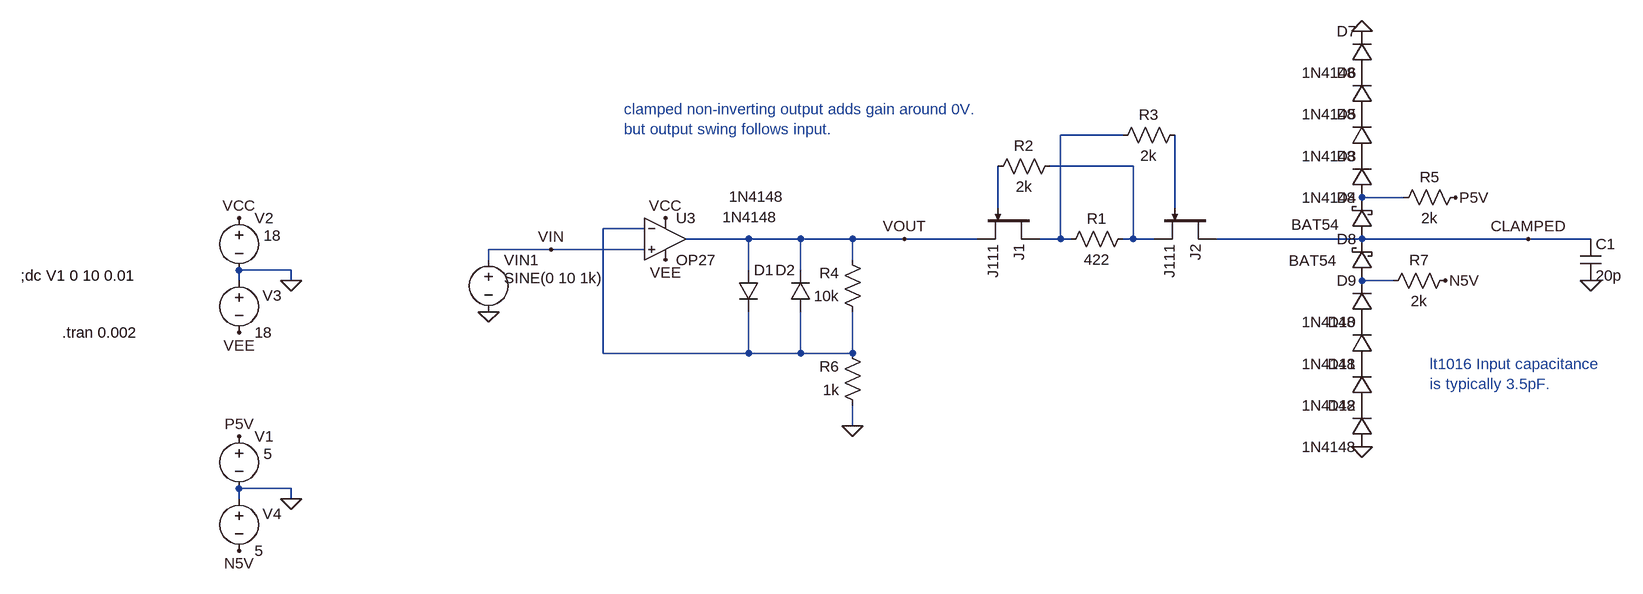
[diagram p0: schematic Draft24.asc]
Draft24.asc, the LTspice schematic file:
Version 4
SHEET 1 3336 1280
WIRE 1216 -176 1120 -176
WIRE 1232 -128 1104 -128
WIRE 1648 -80 1584 -80
WIRE 1024 -64 1024 -128
WIRE 1296 -64 1296 -176
WIRE 480 -32 416 -32
WIRE 640 -16 544 -16
WIRE 720 -16 640 -16
WIRE 800 -16 720 -16
WIRE 880 -16 800 -16
WIRE 992 -16 880 -16
WIRE 1120 -16 1120 -176
WIRE 1120 -16 1088 -16
WIRE 1136 -16 1120 -16
WIRE 1232 -16 1232 -128
WIRE 1232 -16 1216 -16
WIRE 1264 -16 1232 -16
WIRE 1584 -16 1360 -16
WIRE 1840 -16 1584 -16
WIRE 1936 -16 1840 -16
WIRE 336 0 240 0
WIRE 480 0 336 0
WIRE 240 16 240 0
WIRE 800 16 800 -16
WIRE -64 32 -144 32
WIRE 640 32 640 -16
WIRE 720 32 720 -16
WIRE -144 48 -144 32
WIRE -64 48 -64 32
WIRE 1632 48 1584 48
WIRE 416 160 416 -32
WIRE 640 160 640 96
WIRE 640 160 416 160
WIRE 720 160 720 96
WIRE 720 160 640 160
WIRE 800 160 800 96
WIRE 800 160 720 160
WIRE 800 272 800 240
WIRE -64 368 -144 368
WIRE -144 384 -144 368
WIRE -64 384 -64 368
FLAG -64 48 0
FLAG -144 -48 VCC
FLAG -144 128 VEE
FLAG 240 96 0
FLAG 880 -16 VOUT
FLAG 512 -48 VCC
FLAG 512 16 VEE
FLAG 800 272 0
FLAG 336 0 VIN
FLAG 1584 -336 0
FLAG 1584 304 0
FLAG -64 384 0
FLAG -144 288 P5V
FLAG -144 464 N5V
FLAG 1728 -80 P5V
FLAG 1712 48 N5V
FLAG 1936 48 0
FLAG 1840 -16 CLAMPED
SYMBOL voltage -144 -64 R0
WINDOW 123 0 0 Left 0
WINDOW 39 0 0 Left 0
WINDOW 3 38 43 Left 2
SYMATTR Value 18
SYMATTR InstName V2
SYMBOL voltage -144 32 R0
WINDOW 123 0 0 Left 0
WINDOW 39 0 0 Left 0
WINDOW 0 36 39 Left 2
SYMATTR InstName V3
SYMATTR Value 18
SYMBOL voltage 240 0 R0
WINDOW 123 0 0 Left 0
WINDOW 39 0 0 Left 0
WINDOW 3 24 44 Left 2
SYMATTR Value SINE(0 10 1k)
SYMATTR InstName VIN1
SYMBOL res 816 112 R180
WINDOW 0 36 76 Left 2
WINDOW 3 36 40 Left 2
SYMATTR InstName R4
SYMATTR Value 10k
SYMBOL OpAmps\\OP27 512 -80 R0
SYMATTR InstName U3
SYMBOL res 816 256 R180
WINDOW 0 36 76 Left 2
WINDOW 3 36 40 Left 2
SYMATTR InstName R6
SYMATTR Value 1k
SYMBOL diode 624 32 R0
WINDOW 3 -14 -113 Left 2
SYMATTR Value 1N4148
SYMATTR InstName D1
SYMBOL diode 736 96 R180
WINDOW 0 24 64 Left 2
WINDOW 3 51 146 Left 2
SYMATTR InstName D2
SYMATTR Value 1N4148
SYMBOL njf 1088 -64 R90
SYMATTR InstName J1
SYMATTR Value J111
SYMBOL njf 1360 -64 R90
SYMATTR InstName J2
SYMATTR Value J111
SYMBOL res 1232 -32 R90
WINDOW 0 0 56 VBottom 2
WINDOW 3 32 56 VTop 2
SYMATTR InstName R1
SYMATTR Value 422
SYMBOL res 1120 -144 R90
WINDOW 0 0 56 VBottom 2
WINDOW 3 32 56 VTop 2
SYMATTR InstName R2
SYMATTR Value 2k
SYMBOL res 1312 -192 R90
WINDOW 0 0 56 VBottom 2
WINDOW 3 32 56 VTop 2
SYMATTR InstName R3
SYMATTR Value 2k
SYMBOL diode 1600 -80 R180
WINDOW 0 24 64 Left 2
WINDOW 3 24 0 Left 2
SYMATTR InstName D3
SYMATTR Value 1N4148
SYMBOL schottky 1600 -16 R180
WINDOW 0 24 64 Left 2
WINDOW 3 51 22 Left 2
SYMATTR InstName D4
SYMATTR Value BAT54
SYMATTR Description Diode
SYMATTR Type diode
SYMBOL diode 1600 -144 R180
WINDOW 0 24 64 Left 2
WINDOW 3 24 0 Left 2
SYMATTR InstName D5
SYMATTR Value 1N4148
SYMBOL diode 1600 -208 R180
WINDOW 0 24 64 Left 2
WINDOW 3 24 0 Left 2
SYMATTR InstName D6
SYMATTR Value 1N4148
SYMBOL diode 1600 -272 R180
WINDOW 0 24 64 Left 2
WINDOW 3 24 0 Left 2
SYMATTR InstName D7
SYMATTR Value 1N4148
SYMBOL schottky 1600 48 R180
WINDOW 0 24 64 Left 2
WINDOW 3 55 31 Left 2
SYMATTR InstName D8
SYMATTR Value BAT54
SYMATTR Description Diode
SYMATTR Type diode
SYMBOL diode 1600 112 R180
WINDOW 0 24 64 Left 2
WINDOW 3 24 0 Left 2
SYMATTR InstName D9
SYMATTR Value 1N4148
SYMBOL diode 1600 176 R180
WINDOW 0 24 64 Left 2
WINDOW 3 24 0 Left 2
SYMATTR InstName D10
SYMATTR Value 1N4148
SYMBOL diode 1600 240 R180
WINDOW 0 24 64 Left 2
WINDOW 3 24 0 Left 2
SYMATTR InstName D11
SYMATTR Value 1N4148
SYMBOL diode 1600 304 R180
WINDOW 0 24 64 Left 2
WINDOW 3 24 0 Left 2
SYMATTR InstName D12
SYMATTR Value 1N4148
SYMBOL voltage -144 272 R0
WINDOW 123 0 0 Left 0
WINDOW 39 0 0 Left 0
WINDOW 3 38 43 Left 2
SYMATTR Value 5
SYMATTR InstName V1
SYMBOL voltage -144 368 R0
WINDOW 123 0 0 Left 0
WINDOW 39 0 0 Left 0
WINDOW 0 36 39 Left 2
SYMATTR InstName V4
SYMATTR Value 5
SYMBOL res 1744 -96 R90
WINDOW 0 0 56 VBottom 2
WINDOW 3 32 56 VTop 2
SYMATTR InstName R5
SYMATTR Value 2k
SYMBOL res 1728 32 R90
WINDOW 0 0 56 VBottom 2
WINDOW 3 32 56 VTop 2
SYMATTR InstName R7
SYMATTR Value 2k
SYMBOL cap 1920 -16 R0
SYMATTR InstName C1
SYMATTR Value 20p
TEXT -480 40 Left 2 !;dc V1 0 10 0.01
TEXT -416 128 Left 2 !.tran 0.002
TEXT 448 -216 Left 2 ;clamped non-inverting output adds gain around 0V. \nbut output swing follows input.
TEXT 1688 176 Left 2 ;lt1016 Input capacitance\nis typically 3.5pF.

The netlist it stands for:
* Draft24.asc
V2 VCC 0 18
V3 0 VEE 18
VIN1 VIN 0 SINE(0 10 1k)
R4 N006 VOUT 10k
XU3 VIN N006 VCC VEE VOUT OP27  ; pins In+ In- V+ V- OUT
R6 0 N006 1k
D1 VOUT N006 1N4148
D2 N006 VOUT 1N4148
J1 N001 N004 VOUT J111
J2 CLAMPED N005 N002 J111
R1 N002 N001 422
R2 N002 N004 2k
R3 N005 N001 2k
D3 N003 P001 1N4148
D4 CLAMPED N003 BAT54
D5 P001 P002 1N4148
D6 P002 P003 1N4148
D7 P003 0 1N4148
D8 N007 CLAMPED BAT54
D9 P004 N007 1N4148
D10 P005 P004 1N4148
D11 P006 P005 1N4148
D12 0 P006 1N4148
V1 P5V 0 5
V4 0 N5V 5
R5 P5V N003 2k
R7 N5V N007 2k
C1 CLAMPED 0 20p
.model D D
.lib standard.dio
.model NJF NJF
.model PJF PJF
.lib standard.jft
;dc V1 0 10 0.01
.tran 0.002
* clamped non-inverting output adds gain around 0V.
* but output swing follows input.
* lt1016 Input capacitance
* is typically 3.5pF.
.lib ADI.lib
.backanno
.end